# Altium schematic sheet PROC010B_XDS110 Interface_1A.SchDoc: XDS110 Interface_1A
size 431 x 279 mm; Date: Not shown in title block; ApprovedBy: Not shown in title block; CheckedBy: Not shown in title block; Author: Not shown in title block; CompanyName: Not shown in title block; DrawnBy: Adrian Ozer; Engineer: Not shown in title block; Organization: Not shown in title block; Address1: Not shown in title block; Address2: Not shown in title block; Address3: Not shown in title block; Address4: Not shown in title block; DocumentNumber: 12; Revision: Use project parameter SCH_Rev; SheetNumber: 12; SheetTotal: 16; PageSetup: Record=PageOptions|CenterHorizontal=True|CenterVertical=True|PrintScale=1.00|XCorrection=1.00|YCorrection=1.00|PrintKind=0|BorderSize=5000000|LeftOffset=0|BottomOffset=0|Orientation=2|PaperLength=1000|PaperWidth=1000|Scale=100|PaperSource=15|PrintQuality=600|MediaType=1|DitherType=10|PaperKind=Letter|PrintScaleMode=1; CurrentTime: Not shown in title block; CurrentDate: Not shown in title block; Time: Not shown in title block; DocumentFullPathAndName: Not shown in title block; DocumentName: Not shown in title block; ModifiedDate: Not shown in title block; ImagePath: Not shown in title block
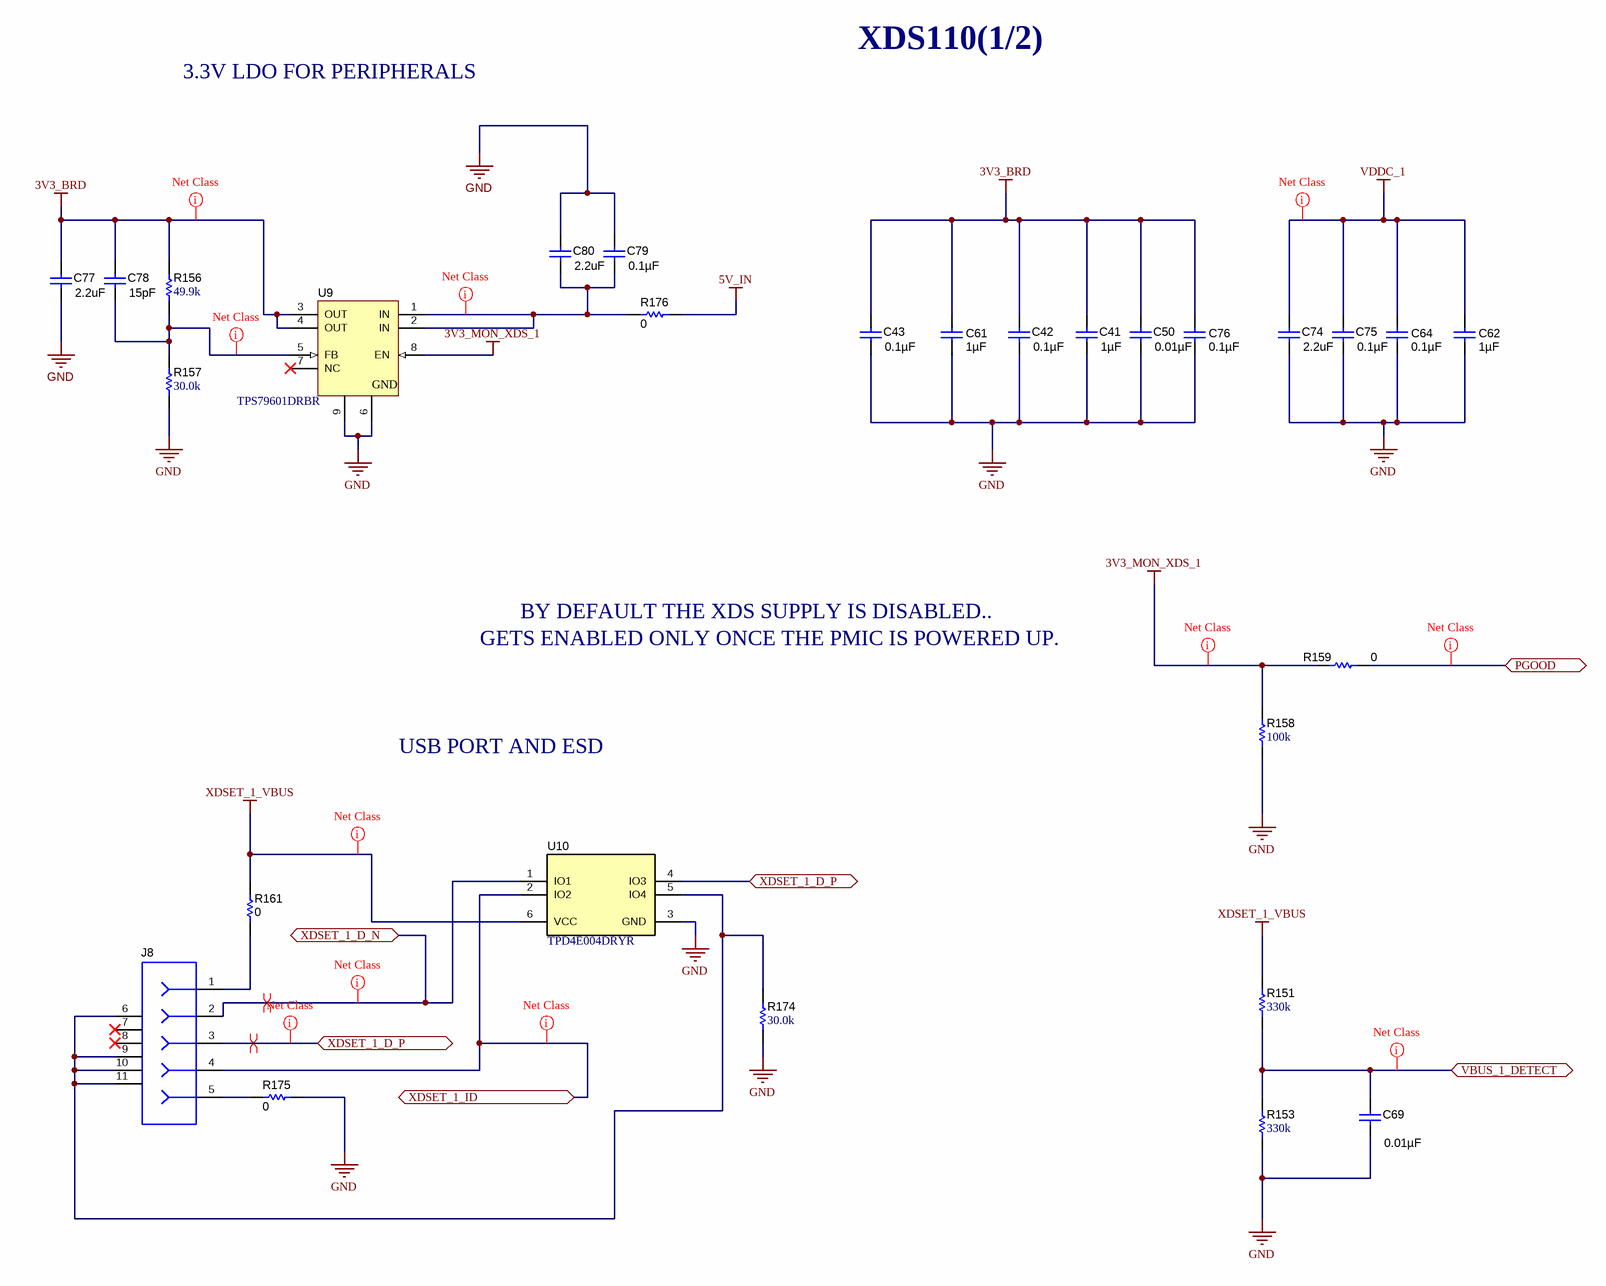
[diagram p0: PROC010B_XDS110 Interface_1A.SchDoc]

## Parts
C41  ValueDisplayed: 1µF  [0402L]  (hidden comment: C1005X7S0J105M050BC)
C42  ValueDisplayed: 0.1µF  [0402L]  (hidden comment: C0402C104K8RACTU)
C43  ValueDisplayed: 0.1µF  [0402L]  (hidden comment: C0402C104K8RACTU)
C50  ValueDisplayed: 0.01µF  [0402L]  (hidden comment: C1005X7R1E103K050BB)
C61  ValueDisplayed: 1µF  [0402L]  (hidden comment: C1005X7S0J105M050BC)
C62  ValueDisplayed: 1µF  [0402L]  (hidden comment: C1005X7S0J105M050BC)
C64  ValueDisplayed: 0.1µF  [0402L]  (hidden comment: C0402C104K8RACTU)
C69  ValueDisplayed: 0.01µF  [0402L]  (hidden comment: C0402C103K4RACTU)
C74  ValueDisplayed: 2.2uF  [0402_065L]  (hidden comment: C1005X7S1A225K050BC)
C75  ValueDisplayed: 0.1µF  [0402L]  (hidden comment: C0402C104K8RACTU)
C76  ValueDisplayed: 0.1µF  [0402L]  (hidden comment: C0402C104K8RACTU)
C77  ValueDisplayed: 2.2uF  [0402_065L]  (hidden comment: C1005X7S1A225K050BC)
C78  ValueDisplayed: 15pF  [0402L]  (hidden comment: 04025A150FAT2A)
C79  ValueDisplayed: 0.1µF  [0402L]  (hidden comment: C0402C104K8RACTU)
C80  ValueDisplayed: 2.2uF  [0402_065L]  (hidden comment: C1005X7S1A225K050BC)
J8  105017-0001  [CONN_105017-0001]  (value not drawn)
R151  ValueDisplayed: 330k  [0402L]  (hidden comment: CRCW0402330KFKED)
R153  ValueDisplayed: 330k  [0402L]  (hidden comment: CRCW0402330KFKED)
R156  ValueDisplayed: 49.9k  [0402L]  (hidden comment: CRCW040249K9FKED)
R157  ValueDisplayed: 30.0k  [0402L]  (hidden comment: CRCW040230K0FKED)
R158  ValueDisplayed: 100k  [0402L]  (hidden comment: CRCW0402100KFKED)
R159  ValueDisplayed: 0  [0402L]  (hidden comment: ERJ-2GE0R00X)
R161  ValueDisplayed: 0  [0603]  (hidden comment: MCT06030Z0000ZP500)
R174  ValueDisplayed: 30.0k  [0402L]  (hidden comment: CRCW040230K0FKED)
R175  ValueDisplayed: 0  [0603]  (hidden comment: MCT06030Z0000ZP500)
R176  ValueDisplayed: 0  [0603]  (hidden comment: MCT06030Z0000ZP500)
U9  TPS79601DRBR  [DRB0008B]
U10  TPD4E004DRYR  [DRY0006A]

## Ports
PGOOD, VBUS_1_DETECT, XDSET_1_D_N, XDSET_1_D_P, XDSET_1_ID

## Nets
3V3_BRD: C41.2 C42.2 C43.2 C50.2 C61.2 C76.2 C77.2 C78.2 R156.2 U9.3(OUT) U9.4(OUT)
3V3_MON_XDS_1: R158.2 R159.2 U9.8(EN)
5V_IN: R176.2
GND: C41.1 C42.1 C43.1 C50.1 C61.1 C62.1 C64.1 C69.1 C74.1 C75.1 C76.1 C77.1 C79.1 C80.1 R153.1 R157.1 R158.1 R174.1 R175.1 U9.6(GND) U9.9(GND) U10.3(GND)
VDDC_1: C62.2 C64.2 C74.2 C75.2
XDSET_1_VBUS: R151.2 R161.2 U10.6(VCC)
PGOOD: R159.1 ; port PGOOD
VBUS_1_DETECT: C69.2 R151.1 R153.2 ; port VBUS_1_DETECT
XDSET_1_D_N: J8.2 U10.1(IO1) ; port XDSET_1_D_N
XDSET_1_D_P: J8.3 U10.4(IO3) ; port XDSET_1_D_P
XDSET_1_ID: J8.4 U10.2(IO2) ; port XDSET_1_ID
NetC78_1: C78.1 R156.1 R157.2 U9.5(FB)
NetC79_2: C79.2 C80.2 R176.1 U9.1(IN) U9.2(IN)
NetJ8_1: J8.1 R161.1
NetJ8_5: J8.5 R175.2
NetJ8_6: J8.6 J8.9 J8.10 J8.11 R174.2 U10.5(IO4)

Not connected (* = marked no-connect by the designer): J8 7* 8*; U9 7(NC)*

## Layout directives
differential pair: XDSET_1_D_N, XDSET_1_D_P
net class PWR: 3V3_BRD, 3V3_MON_XDS_1, NetC78_1, NetC79_2, VDDC_1, XDSET_1_VBUS
net class USB: XDSET_1_D_N, XDSET_1_D_P
net class GENERAL: PGOOD, VBUS_1_DETECT, XDSET_1_ID

## Notes on the sheet
- XDS110(1/2)
- 3.3V LDO FOR PERIPHERALS
- GETS ENABLED ONLY ONCE THE PMIC IS POWERED UP.
- BY DEFAULT THE XDS SUPPLY IS DISABLED..
- USB PORT AND ESD
- Drawn By:
- SVN Rev:
- Number:
- TID #:
- Orderable:
- Rev:
- Sheet Title:
- File:
- Project Title:
- Designed for:
- Assembly Variant:
- Mod. Date:
- Sheet:
- Size:
- of
- B
- http://www.ti.com
- Texas Instruments and/or its licensors do not warrant the accuracy or completeness of this specification or any information contained therein. Texas Instruments and/or its licensors do not warrant that this design will meet the specifications, will be suitable for your application or fit for any particular purpose, or will operate in an implementation. Texas Instruments and/or its licensors do not warrant that the design is production worthy. You should completely validate and test your design implementation to confirm the system functionality for your application.
- Engineer:
- Contact:
- © Texas Instruments

## Library data of the parts
C41 C61 C62 = CMP-0078222-1: CAP, CERM, 1 µF, 6.3 V,+/- 20%, X7S, 0402; Manufacturer: TDK; TaMin_C: -55°C; Polarized: N; SizeAreaWB_mm2: 3; U/M: EA; Value: 1uF; TaMax_C: 125°C; SizeZ_mm: 0.6; SizeX_mm: 1; SizeY_mm: 0.5; Cap_Case: 0402; Value2: 6.3V; AEC Category: Q200; ComponentLink1URL: https://product.tdk.com/info/en/catalog/datasheets/mlcc_commercial_general_en.pdf; Supplier Part Number 2: 810-C1005X7S0J105M; Supplier 2: Mouser; TempCo: X7S; RoHS: Y; MountType: SMT; Supplier 1: Digi-Key; PackageReference: 0402; Tolerance_%: 20%; SizeArea_mm2: 0.5; CompType: Capacitor; PartNumber: C1005X7S0J105M050BC; AEC Qualified: N; Cap_F: 1µF; VDC_V: 6.3V; ComponentLink1Description: Datasheet link; AEC Grade: N/A; Supplier Part Number 1: 445-9080-1-ND; Technology: Ceramic
C42 C43 C64 C75 C76 C79 = CMP-0078241-1: CAP, CERM, 0.1 µF, 10 V,+/- 10%, X7R, 0402; Manufacturer: Kemet; TaMin_C: -55°C; Polarized: N; SizeAreaWB_mm2: 3; U/M: EA; Value: 0.1uF; TaMax_C: 125°C; SizeZ_mm: 0.6; SizeX_mm: 1; SizeY_mm: 0.5; Cap_Case: 0402; Value2: 10V; Cap_F: 100nF; AEC Category: Q200; ComponentLink1URL: https://content.kemet.com/datasheets/KEM_C1002_X7R_SMD.pdf; Supplier Part Number 2: 68X2393; Supplier 2: Newark; Supplier Part Number 3: 80-C0402C104K8R; TempCo: X7R; Supplier 3: Mouser; RoHS: Y; MountType: SMT; Supplier 1: Digi-Key; PackageReference: 0402; Tolerance_%: 10%; SizeArea_mm2: 0.5; CompType: Capacitor; PartNumber: C0402C104K8RACTU; AEC Qualified: N; VDC_V: 10V; ComponentLink1Description: Datasheet link; AEC Grade: N/A; Supplier Part Number 1: 399-3520-1-ND; Technology: Ceramic
C50 = CMP-0078220-1: CAP, CERM, 0.01 µF, 25 V,+/- 10%, X7R, 0402; Manufacturer: TDK; TaMin_C: -55°C; Polarized: N; Green_Lifecycle: NRND; SizeAreaWB_mm2: 3; Green_REACh: Passed; U/M: EA; Value: 0.01uF; TaMax_C: 125°C; SizeZ_mm: 0.6; SizeX_mm: 1; SizeY_mm: 0.5; Cap_Case: 0402; Value2: 25V; Cap_F: 10nF; AEC Category: Q200; ComponentLink1URL: https://product.tdk.com/info/en/catalog/datasheets/mlcc_commercial_general_en.pdf; Supplier Part Number 2: 90R7604; Supplier 2: Newark; Supplier Part Number 3: 810-C1005X7R1E103K; TempCo: X7R; Supplier 3: Mouser; RoHS: Y; MountType: SMT; Green_EU RoHS-2: Passed; Supplier 1: Digi-Key; Green_EU RoHS: Passed; PackageReference: 0402; Tolerance_%: 10%; SizeArea_mm2: 0.5; CompType: Capacitor; PartNumber: C1005X7R1E103K050BB; AEC Qualified: N; VDC_V: 25V; ComponentLink1Description: Datasheet link; AEC Grade: N/A; Supplier Part Number 1: 445-1260-1-ND; Technology: Ceramic
C69 = CMP-0078218-1: CAP, CERM, 0.01 µF, 16 V,+/- 10%, X7R, 0402; Manufacturer: Kemet; TaMin_C: -55°C; Polarized: N; Green_Lifecycle: Active; SizeAreaWB_mm2: 3; Green_REACh: Passed; U/M: EA; Value: 0.01uF; TaMax_C: 125°C; SizeZ_mm: 0.6; SizeX_mm: 1; SizeY_mm: 0.5; Cap_Case: 0402; Value2: 16V; Cap_F: 10nF; AEC Category: Q200; ComponentLink1URL: https://content.kemet.com/datasheets/KEM_C1002_X7R_SMD.pdf; Supplier Part Number 2: 66W8706; Supplier 2: Newark; Supplier Part Number 3: 80-C0402C103K4R; TempCo: X7R; Supplier 3: Mouser; RoHS: Y; MountType: SMT; Green_EU RoHS-2: Passed; Supplier 1: Digi-Key; Green_EU RoHS: Passed; PackageReference: 0402; Tolerance_%: 10%; SizeArea_mm2: 0.5; CompType: Capacitor; PartNumber: C0402C103K4RACTU; AEC Qualified: N; VDC_V: 16V; ComponentLink1Description: Datasheet link; AEC Grade: N/A; Supplier Part Number 1: 399-1038-1-ND; Technology: Ceramic
C74 C77 C80 = CMP-0006302-2: CAP, CERM, 2.2 uF, 10 V, +/- 10%, X7S, 0402; Manufacturer: TDK; TaMin_C: -55°C; ESR_ohm: 5.925m; Polarized: N; SizeAreaWB_mm2: 3; Value1: 0.005925 ohm; U/M: EA; Value: 2.2uF; TaMax_C: 125°C; SizeZ_mm: 0.65; SizeX_mm: 1; SizeY_mm: 0.5; Cap_Case: 0402_065; Value2: 10V; CompType: Capacitor; Cap_F: 2.2µF; IRMS_A: 2.05591A; AEC Category: Q200; Supplier Part Number 2: 810-C1005X7S1A225K; Publisher: Texas Instruments; Supplier 2: Mouser; TempCo: X7S; Published: 2008-06-19; RoHS: Y; MountType: SMT; Supplier 1: Digi-Key; PackageReference: 0402; Tolerance_%: 10%; SizeArea_mm2: 0.5; LatestRevisionDate: 2017-03-09; PartNumber: C1005X7S1A225K050BC; AEC Qualified: N; VDC_V: 10V; ComponentLink1Description: Datasheet link; AEC Grade: N/A; Supplier Part Number 1: 445-9097-1-ND; Technology: Ceramic; ComponentLink1URL: https://product.tdk.com/en/search/capacitor/ceramic/mlcc/info?part_no=C1005X7S1A225K050BC
C78 = CMP-0078217-1: CAP, CERM, 15 pF, 50 V,+/- 1%, C0G/NP0, 0402; Manufacturer: AVX; TaMin_C: -55°C; Polarized: N; Green_Lifecycle: Not Set; SizeAreaWB_mm2: 3; Green_REACh: Incomplete; U/M: EA; Value: 15pF; TaMax_C: 125°C; SizeZ_mm: 0.6; SizeX_mm: 1; SizeY_mm: 0.5; Cap_Case: 0402; Value2: 50V; AEC Category: Q200; ComponentLink1URL: http://datasheets.avx.com/C0GNP0-Dielectric.pdf; Supplier Part Number 2: 581-04025A150F; Supplier 2: Mouser; TempCo: C0G/NP0; RoHS: Y; MountType: SMT; Green_EU RoHS-2: Incomplete; Supplier 1: Digi-Key; Green_EU RoHS: Incomplete; PackageReference: 0402; Tolerance_%: 1%; SizeArea_mm2: 0.5; CompType: Capacitor; PartNumber: 04025A150FAT2A; AEC Qualified: N; Cap_F: 15pF; VDC_V: 50V; ComponentLink1Description: Datasheet link; AEC Grade: N/A; Supplier Part Number 1: 478-5126-1-ND; Technology: Ceramic
J8 = CMP-0055293-1: Connector, Receptacle, Micro-USB Type B, R/A, Bottom Mount SMT; Manufacturer: Molex; CNHeader: FALSE; Green_Lifecycle: Active; Gender: Female; Green_REACh: Passed; CompType: USB; CT: TRUE; ComponentLink1URL: http://www.molex.com/pdm_docs/sd/1050170001_sd.pdf; Supplier Part Number 2: 78R1699; Publisher: Texas Instruments; Supplier 2: Newark; Supplier Part Number 3: 538-105017-0001; Supplier 3: Mouser; RoHS: Y; MountType: SMT; Green_EU RoHS-2: Passed; Supplier 1: Digi-Key; Green_EU RoHS: Passed; PackageReference: Micro USB receptacle; LatestRevisionDate: 26/05/2017; PartNumber: 105017-0001; ComponentLink1Description: Datasheet URL; Supplier Part Number 1: WM1399CT-ND
R151 R153 = CMP-0078210-2: RES, 330 k, 1%, 0.063 W, AEC-Q200 Grade 0, 0402; Manufacturer: Vishay-Dale; SizeArea_mm2: 0.5; AEC Qualified: Y; AEC Category: Q200; Value: 330k; SizeZ_mm: 0.6; TempCo: 100 ppm/C; AEC Grade: 0; Power_W: 63mW; VDC_V: 50V; Value2: 0.063W; SizeX_mm: 1; ComponentLink1Description: Datasheet link; RoHS: E; Supplier Part Number 3: 71-CRCW0402-330K-E3; Tolerance_%: 1%; Value_Code: 330k; Supplier 1: Digi-Key; PackageReference: 0402; Technology: Thick Film; Res_ohm: 330k; PartNumber: CRCW0402330KFKED; Supplier Part Number 2: 72M6783; Supplier 2: Newark; SizeY_mm: 0.5; ComponentLink1URL: http://www.vishay.com/docs/20035/dcrcwe3.pdf; Value1: 1%; CompType: Resistor; MountType: SMT; Supplier Part Number 1: 541-330KLCT-ND; Supplier 3: Mouser
R156 = CMP-0026403-2: RES, 49.9 k, 1%, 0.063 W, AEC-Q200 Grade 0, 0402; Manufacturer: Vishay-Dale; Power_W: 63mW; TempCo: 100 ppm/C; Value_Code: 49k9; Value: 49.9k; EIA_Code: E96; SizeX_mm: 1; SizeY_mm: 0.5; SizeZ_mm: 0.6; Value2: 0.063W; AEC Qualified: Y; VDC_V: 50V; AEC Category: Q200; AEC Grade: 0; ComponentLink1URL: http://www.vishay.com/docs/20035/dcrcwe3.pdf; Supplier Part Number 2: 52K7113; Supplier 2: Newark; Supplier Part Number 3: 71-CRCW0402-49.9K-E3; Supplier 3: Mouser; RoHS: E; Value1: 1%; MountType: SMT; Supplier 1: Digi-Key; PackageReference: 0402; Tolerance_%: 1%; Res_ohm: 49.9k; SizeArea_mm2: 0.5; CompType: Resistor; PartNumber: CRCW040249K9FKED; ComponentLink1Description: Datasheet link; Supplier Part Number 1: 541-49.9KLCT-ND; Technology: Thick Film
R157 R174 = CMP-0078244-2: RES, 30.0 k, 1%, 0.063 W, AEC-Q200 Grade 0, 0402; Manufacturer: Vishay-Dale; Power_W: 63mW; Green_Lifecycle: Active; TempCo: 100 ppm/C; Value_Code: 30k0; Green_REACh: Passed; Value: 30.0k; Res_ohm: 30k; SizeX_mm: 1; SizeY_mm: 0.5; SizeZ_mm: 0.6; Value2: 0.063W; AEC Qualified: Y; VDC_V: 50V; AEC Grade: 0; AEC Category: Q200; ComponentLink1URL: http://www.vishay.com/docs/20035/dcrcwe3.pdf; Supplier Part Number 2: 52K6953; Supplier 2: Newark; Supplier Part Number 3: 71-CRCW0402-30K-E3; Supplier 3: Mouser; RoHS: E; Value1: 1%; MountType: SMT; Green_EU RoHS-2: Passed; Supplier 1: Digi-Key; Green_EU RoHS: Passed with Exemption; PackageReference: 0402; Tolerance_%: 1%; SizeArea_mm2: 0.5; CompType: Resistor; PartNumber: CRCW040230K0FKED; ComponentLink1Description: Datasheet link; Supplier Part Number 1: 541-30.0KLCT-ND; Technology: Thick Film
R158 = CMP-0025950-3: RES, 100 k, 1%, 0.063 W, AEC-Q200 Grade 0, 0402; Manufacturer: Vishay-Dale; Power_W: 63mW; TempCo: 100 ppm/C; Value: 100k; EIA_Code: E96; SizeX_mm: 1; SizeY_mm: 0.5; SizeZ_mm: 0.6; Value2: 0.063W; AEC Qualified: Y; VDC_V: 50V; AEC Category: Q200; AEC Grade: 0; Supplier Part Number 2: 52K6607; Supplier 2: Newark; Supplier Part Number 3: 71-CRCW0402-100K-E3; Supplier 3: Mouser; Value_Code: 100k; RoHS: E; Value1: 1%; MountType: SMT; Supplier 1: Digi-Key; PackageReference: 0402; Tolerance_%: 1%; Res_ohm: 100k; SizeArea_mm2: 0.5; CompType: Resistor; PartNumber: CRCW0402100KFKED; ComponentLink1Description: Datasheet link; Supplier Part Number 1: 541-100KLCT-ND; Technology: Thick Film; ComponentLink1URL: http://www.vishay.com/docs/20035/dcrcwe3.pdf
R159 = CMP-0026992-2: RES, 0, 5%, 0.063 W, 0402; Manufacturer: Panasonic; Power_W: 63mW; TempCo: 600 ppm/C; Value_Code: 0000; U/M: EA; Value: 0; EIA_Code: E24; SizeX_mm: 1; SizeY_mm: 0.5; SizeZ_mm: 0.6; Value2: 0.063W; VDC_V: 50V; AEC Category: Q200; Supplier Part Number 2: 65T8307; Publisher: Texas Instruments; Supplier 2: Newark; Supplier Part Number 3: 667-ERJ-2GE0R00X; Supplier 3: Mouser; Published: 2008-06-26; RoHS: Y; Value1: 5%; MountType: SMT; Supplier 1: Digi-Key; PackageReference: 0402; Tolerance_%: 5%; Res_ohm: 0; SizeArea_mm2: 0.5; CompType: Resistor; LatestRevisionDate: 2017-03-09; PartNumber: ERJ-2GE0R00X; AEC Qualified: ?; ComponentLink1Description: Datasheet link; Supplier Part Number 1: P0.0JCT-ND; Technology: Thick Film; ComponentLink1URL: http://www.panasonic.com/industrial/components/pdf/AOA0000CE1.pdf
R161 R175 R176 = CMP-0025884-3: RES, 0, 5%, 0.125 W, 0603; Manufacturer: Vishay/Beyschlag; Power_W: 125mW; TempCo: ppm/C; Value_Code: 0000; U/M: EA; Value: 0; EIA_Code: E24; SizeX_mm: 1.6; SizeY_mm: 0.8; SizeZ_mm: 1; Value2: 0.125W; SizeArea_mm2: 1.28; AEC Qualified: N; AEC Category: Q200; Supplier Part Number 2: 96Y9454; Publisher: Texas Instruments; Supplier 2: Newark; Supplier Part Number 3: 594-MCT06030Z0000ZP5; Supplier 3: Mouser; Published: 2008-06-26; RoHS: Y; Value1: 5%; MountType: SMT; Supplier 1: Digi-Key; PackageReference: 0603; Tolerance_%: 5%; Res_ohm: 0; CompType: Resistor; LatestRevisionDate: 2017-03-09; PartNumber: MCT06030Z0000ZP500; ComponentLink1Description: Datasheet link; AEC Grade: N/A; Supplier Part Number 1: MCT0603-0.0-ZZCT-ND; Technology: Thin Film; ComponentLink1URL: http://www.vishay.com/docs/28705/mcx0x0xpro.pdf
U9 = CMP-0036402-3: Single Output High PSRR LDO, 1 A, Adjustable 1.2 to 5.5 V Output, 2.7 to 5.5 V Input, 8-pin SON (DRB), -40 to 125 degC, Green (RoHS & no Sb/Br); Manufacturer: Texas Instruments; Vin(Min)(V): 2.7; Vout Adj(Max)(V): 5.5; Vout Adj(Min)(V): 1.2; Accuracy(%): 2; SubFamily: Single Channel LDO; Iq(Typ)(mA): 0.26; Vdo(Typ)(mV): 250; Iout(Max)(A): 1; AEC Category: Q200; AEC Qualified: N; CompType: IC; SizeArea_mm2: 9.0; SizeAreaWB_mm2: 16.0; SizeX_mm: 3.0; SizeZ_mm: 1.0; ComponentLink1URL: http://www.ti.com/; Vin(Max)(V): 5.5; PackageDescription: VSON-8; ComponentLink2URL: http://www.ti.com/general/docs/lit/getliterature.tsp?genericPartNumber=TPS79601&fileType=pdf; ComponentLink3Description: Package Specification; Eco-Plan: Green (RoHS & no Sb/Br); ComponentLink2Description: Datasheet; ComponentLink3URL: http://www.ti.com/litv/pdf/mpds118h; PackageReference: DRB0008B; DatasheetVersion: SLVS351N; PartNumber: TPS79601DRBR; PackageVersion: 4203482-2/K; ComponentLink1Description: Manufacturer URL; MountType: SMT; RoHS: Y; SizeY_mm: 3.0
U10 = CMP-0043115-2: ESD-Protection Array for High-Speed Data Interfaces, 4 Channels, -40 to +85 degC, 6-pin SON (DRY), Green (RoHS & no Sb/Br); Manufacturer: Texas Instruments; IO Leakage Current(nA): 1; USB High Speed: TRUE; IO Capacitance(Typ)(pF): 1.6; SubFamily: ESD Solution; IEC 61000-4-2 Contact(+/- kV): 8; Breakdown Voltage(Min)(V): 6; IEC 61000-4-2 Air-Gap(+/- kV): 12; AEC Category: Q200; AEC Qualified: N; CompType: IC; SizeArea_mm2: 1.45; SizeAreaWB_mm2: 4.9; SizeX_mm: 1.0; SizeZ_mm: 0.6; PackageVersion: revF, Dec-2011; ComponentLink3URL: http://www.ti.com/product/tpd4e004/datasheet; DatasheetVersion: SLVS729A; Eco-Plan: Green (RoHS & no Sb/Br); ComponentLink1Description: Datasheet Link; Mounting Technology: Surface Mount; ComponentLink2URL: http://www.ti.com/product/tpd4e004; ComponentLink1URL: http://www.ti.com/lit/ds/symlink/tpd4e004.pdf; PackageDescription: USON-6; 1394 / Firewire: TRUE; PackageReference: DRY0006A; ComponentLink3Description: Online Datasheet; ComponentLink2Description: Product Folder; Serial ATA / eSATA: TRUE; PartNumber: TPD4E004DRYR; MountType: SMT; RoHS: Y; SizeY_mm: 1.45